# Altium schematic sheet FPGA.SchDoc: =ProjectName
size 420 x 297 mm; Author: T.P.; CompanyName: WUT; DrawnBy: T.P.; Organization: WUT ISE; Address1: Warsaw Univeristy of Technology; Address2: Nowowiejska 15/19; DocumentNumber: 3; Revision: 0.9; SheetNumber: 3; SheetTotal: 36; EDA_Number: ARTIQ; Projet: ARTIQ/SINARA; ModifiedBy: -; CreateDate: XX/XX/XXXX; CheckedDate: -; Title2: FPGA.SchDoc; DivGrp: ISE; Designer: G.K. and T.P.; ModifiedDate: -; ProjectName: ADC/DAC MEZZANINE
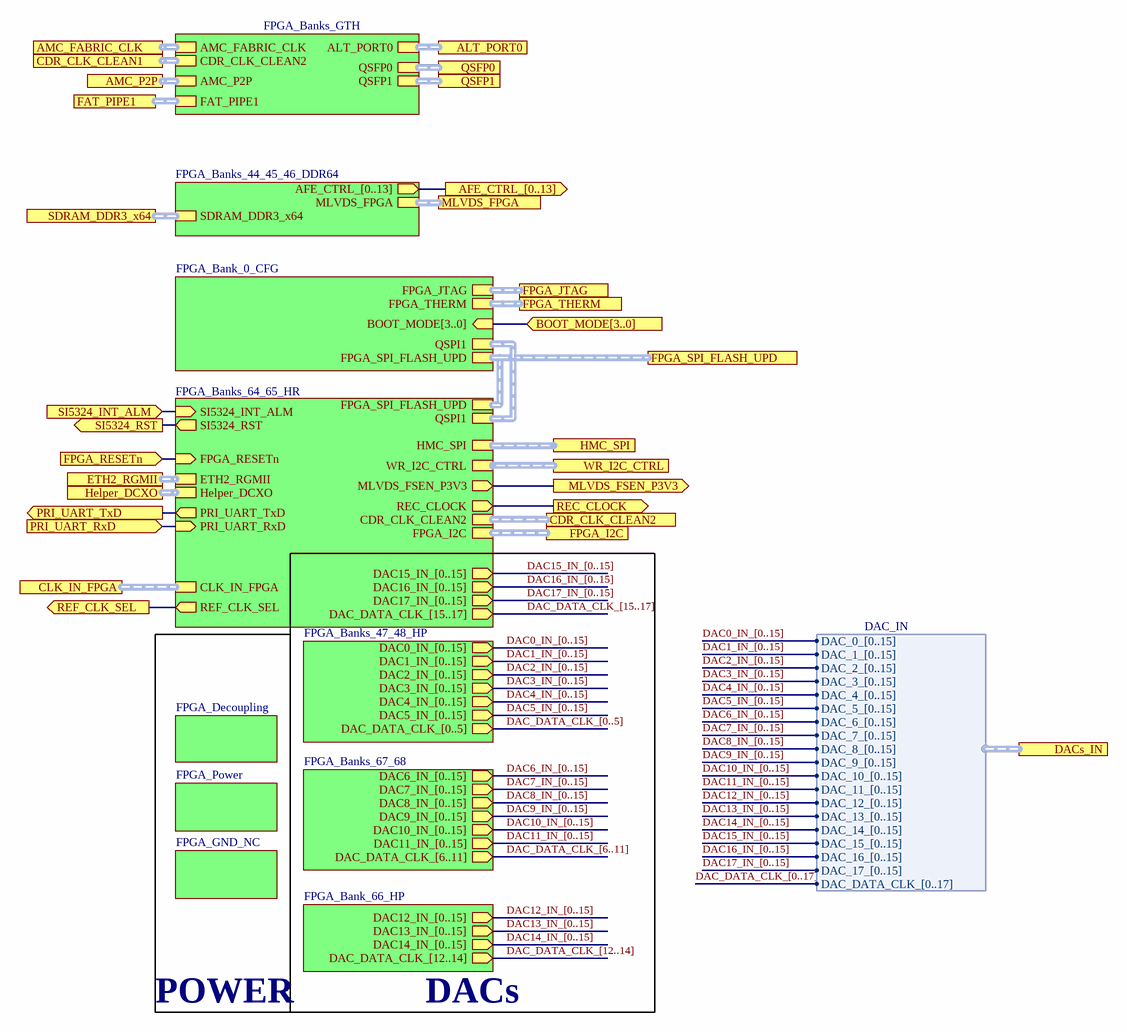
[diagram p0: FPGA.SchDoc]

## Sub-sheets
FPGA_Bank_0_CFG = FPGA_Bank_0_CFG.SchDoc: FPGA_SPI_FLASH_UPD (harness FLASH), FPGA_THERM (harness FPGA_THERM), BOOT_MODE[3..0] (in), FPGA_JTAG (harness JTAG), QSPI1
FPGA_Bank_66_HP = FPGA_Bank_66_HP.SchDoc: DAC12_IN_[0..15] (out), DAC14_IN_[0..15] (out), DAC13_IN_[0..15] (out), DAC_DATA_CLK_[12..14] (out)
FPGA_Banks_44_45_46_DDR64 = FPGA_Banks_44_45_46_DDR64.SchDoc: SDRAM_DDR3_x64 (harness SDRAM_64), MLVDS_FPGA (harness MLVDS_FPGA), AFE_CTRL_[0..13] (out)
FPGA_Banks_47_48_HP = FPGA_Banks_47_48_HP.SchDoc: DAC5_IN_[0..15] (out), DAC3_IN_[0..15] (out), DAC4_IN_[0..15] (out), DAC2_IN_[0..15] (out), DAC1_IN_[0..15] (out), DAC0_IN_[0..15] (out), DAC_DATA_CLK_[0..5] (out)
FPGA_Banks_64_65_HR = FPGA_Banks_64_65_HR.SchDoc: PRI_UART_TxD (out), SI5324_INT_ALM (in), FPGA_I2C (harness I2C), FPGA_RESETn (in), PRI_UART_RxD (in), SI5324_RST (out), FPGA_SPI_FLASH_UPD (harness FLASH), DAC17_IN_[0..15] (out), DAC15_IN_[0..15] (out), DAC16_IN_[0..15] (out), REF_CLK_SEL (out), DAC_DATA_CLK_[15..17] (out), CDR_CLK_CLEAN2 (harness CLK), REC_CLOCK (out), CLK_IN_FPGA (harness CLK), MLVDS_FSEN_P3V3 (out), QSPI1 (harness QSPI), WR_I2C_CTRL (harness WR_I2C_CTRL), HMC_SPI (harness SPI), Helper_DCXO (harness CLK), ETH2_RGMII (harness RGMII)
FPGA_Banks_67_68 = FPGA_Banks_67_68.SchDoc: DAC6_IN_[0..15] (out), DAC9_IN_[0..15] (out), DAC8_IN_[0..15] (out), DAC7_IN_[0..15] (out), DAC11_IN_[0..15] (out), DAC_DATA_CLK_[6..11] (out), DAC10_IN_[0..15] (out)
FPGA_Banks_GTH = FPGA_Banks_GTH.SchDoc: AMC_FABRIC_CLK (harness AMC_FABRIC_CLOCK), FAT_PIPE1 (harness FAT_PIPE1), CDR_CLK_CLEAN2 (harness CLK), AMC_P2P (harness P2P), QSFP0 (harness QSFP), ALT_PORT0 (harness PORT0), QSFP1 (harness QSFP)
FPGA_Decoupling = FPGA_Decoupling.SchDoc: no entries
FPGA_GND_NC = FPGA_GND_NC.SchDoc: no entries
FPGA_Power = FPGA_Power.SchDoc: no entries

## Ports
AFE_CTRL_[0..13] (out), ALT_PORT0 (harness PORT0), AMC_FABRIC_CLK (harness AMC_FABRIC_CLOCK), AMC_P2P (harness P2P), BOOT_MODE[3..0] (in), CDR_CLK_CLEAN1 (harness CLK), CDR_CLK_CLEAN2 (harness CLK), CLK_IN_FPGA (harness CLK), DACs_IN (harness DAC_IN), ETH2_RGMII (harness RGMII), FAT_PIPE1 (harness FAT_PIPE1), FPGA_I2C (harness I2C), FPGA_JTAG (harness JTAG), FPGA_RESETn (in), FPGA_SPI_FLASH_UPD (harness FLASH), FPGA_THERM (harness FPGA_THERM), Helper_DCXO (harness CLK), HMC_SPI (harness SPI), MLVDS_FPGA (harness MLVDS_FPGA), MLVDS_FSEN_P3V3 (out), PRI_UART_RxD (in), PRI_UART_TxD (out), QSFP0 (harness QSFP), QSFP1 (harness QSFP), REC_CLOCK (out), REF_CLK_SEL (out), SDRAM_DDR3_x64 (harness SDRAM_64), SI5324_INT_ALM (in), SI5324_RST (out), WR_I2C_CTRL (harness WR_I2C_CTRL)

## Harnesses
DAC_IN: DAC_0_[0..15], DAC_1_[0..15], DAC_2_[0..15], DAC_3_[0..15], DAC_4_[0..15], DAC_5_[0..15], DAC_6_[0..15], DAC_7_[0..15], DAC_8_[0..15], DAC_9_[0..15], DAC_10_[0..15], DAC_11_[0..15], DAC_12_[0..15], DAC_13_[0..15], DAC_14_[0..15], DAC_15_[0..15], DAC_16_[0..15], DAC_17_[0..15], DAC_DATA_CLK_[0..17]

## Nets
FPGA_RESETn: port FPGA_RESETn, sheet FPGA_Banks_64_65_HR/FPGA_RESETn
MLVDS_FSEN_P3V3: port MLVDS_FSEN_P3V3, sheet FPGA_Banks_64_65_HR/MLVDS_FSEN_P3V3
PRI_UART_RxD: port PRI_UART_RxD, sheet FPGA_Banks_64_65_HR/PRI_UART_RxD
PRI_UART_TxD: port PRI_UART_TxD, sheet FPGA_Banks_64_65_HR/PRI_UART_TxD
REC_CLOCK: port REC_CLOCK, sheet FPGA_Banks_64_65_HR/REC_CLOCK
REF_CLK_SEL: port REF_CLK_SEL, sheet FPGA_Banks_64_65_HR/REF_CLK_SEL
SI5324_INT_ALM: port SI5324_INT_ALM, sheet FPGA_Banks_64_65_HR/SI5324_INT_ALM
SI5324_RST: port SI5324_RST, sheet FPGA_Banks_64_65_HR/SI5324_RST

## Buses and harness runs
bus DAC0_IN_[0..15]
bus DAC0_IN_[0..15] = sheet FPGA_Banks_47_48_HP/DAC0_IN_[0..15]
bus DAC1_IN_[0..15]
bus DAC1_IN_[0..15] = sheet FPGA_Banks_47_48_HP/DAC1_IN_[0..15]
bus DAC2_IN_[0..15]
bus DAC2_IN_[0..15] = sheet FPGA_Banks_47_48_HP/DAC2_IN_[0..15]
bus DAC3_IN_[0..15]
bus DAC3_IN_[0..15] = sheet FPGA_Banks_47_48_HP/DAC3_IN_[0..15]
bus DAC4_IN_[0..15]
bus DAC4_IN_[0..15] = sheet FPGA_Banks_47_48_HP/DAC4_IN_[0..15]
bus DAC5_IN_[0..15]
bus DAC5_IN_[0..15] = sheet FPGA_Banks_47_48_HP/DAC5_IN_[0..15]
bus DAC6_IN_[0..15]
bus DAC6_IN_[0..15] = sheet FPGA_Banks_67_68/DAC6_IN_[0..15]
bus DAC7_IN_[0..15]
bus DAC7_IN_[0..15] = sheet FPGA_Banks_67_68/DAC7_IN_[0..15]
bus DAC8_IN_[0..15]
bus DAC8_IN_[0..15] = sheet FPGA_Banks_67_68/DAC8_IN_[0..15]
bus DAC9_IN_[0..15]
bus DAC9_IN_[0..15] = sheet FPGA_Banks_67_68/DAC9_IN_[0..15]
bus DAC10_IN_[0..15]
bus DAC10_IN_[0..15] = sheet FPGA_Banks_67_68/DAC10_IN_[0..15]
bus DAC11_IN_[0..15]
bus DAC11_IN_[0..15] = sheet FPGA_Banks_67_68/DAC11_IN_[0..15]
bus DAC12_IN_[0..15]
bus DAC12_IN_[0..15] = sheet FPGA_Bank_66_HP/DAC12_IN_[0..15]
bus DAC13_IN_[0..15]
bus DAC13_IN_[0..15] = sheet FPGA_Bank_66_HP/DAC13_IN_[0..15]
bus DAC14_IN_[0..15]
bus DAC14_IN_[0..15] = sheet FPGA_Bank_66_HP/DAC14_IN_[0..15]
bus DAC15_IN_[0..15]
bus DAC15_IN_[0..15] = sheet FPGA_Banks_64_65_HR/DAC15_IN_[0..15]
bus DAC16_IN_[0..15]
bus DAC16_IN_[0..15] = sheet FPGA_Banks_64_65_HR/DAC16_IN_[0..15]
bus DAC17_IN_[0..15]
bus DAC17_IN_[0..15] = sheet FPGA_Banks_64_65_HR/DAC17_IN_[0..15]
bus DAC_DATA_CLK_[0..5] = sheet FPGA_Banks_47_48_HP/DAC_DATA_CLK_[0..5]
bus DAC_DATA_CLK_[0..17]
bus DAC_DATA_CLK_[6..11] = sheet FPGA_Banks_67_68/DAC_DATA_CLK_[6..11]
bus DAC_DATA_CLK_[12..14] = sheet FPGA_Bank_66_HP/DAC_DATA_CLK_[12..14]
bus DAC_DATA_CLK_[15..17] = sheet FPGA_Banks_64_65_HR/DAC_DATA_CLK_[15..17]
bus port AFE_CTRL_[0..13] = sheet FPGA_Banks_44_45_46_DDR64/AFE_CTRL_[0..13]
bus port BOOT_MODE[3..0] = sheet FPGA_Bank_0_CFG/BOOT_MODE[3..0]
harness port ALT_PORT0 = sheet FPGA_Banks_GTH/ALT_PORT0
harness port AMC_FABRIC_CLK = sheet FPGA_Banks_GTH/AMC_FABRIC_CLK
harness port AMC_P2P = sheet FPGA_Banks_GTH/AMC_P2P
harness port CDR_CLK_CLEAN1 = sheet FPGA_Banks_GTH/CDR_CLK_CLEAN2
harness port CDR_CLK_CLEAN2 = sheet FPGA_Banks_64_65_HR/CDR_CLK_CLEAN2
harness port CLK_IN_FPGA = sheet FPGA_Banks_64_65_HR/CLK_IN_FPGA
harness port ETH2_RGMII = sheet FPGA_Banks_64_65_HR/ETH2_RGMII
harness port FAT_PIPE1 = sheet FPGA_Banks_GTH/FAT_PIPE1
harness port FPGA_I2C = sheet FPGA_Banks_64_65_HR/FPGA_I2C
harness port FPGA_JTAG = sheet FPGA_Bank_0_CFG/FPGA_JTAG
harness port FPGA_SPI_FLASH_UPD = sheet FPGA_Bank_0_CFG/FPGA_SPI_FLASH_UPD = sheet FPGA_Banks_64_65_HR/FPGA_SPI_FLASH_UPD
harness port FPGA_THERM = sheet FPGA_Bank_0_CFG/FPGA_THERM
harness port Helper_DCXO = sheet FPGA_Banks_64_65_HR/Helper_DCXO
harness port HMC_SPI = sheet FPGA_Banks_64_65_HR/HMC_SPI
harness port MLVDS_FPGA = sheet FPGA_Banks_44_45_46_DDR64/MLVDS_FPGA
harness port QSFP0 = sheet FPGA_Banks_GTH/QSFP0
harness port QSFP1 = sheet FPGA_Banks_GTH/QSFP1
harness port SDRAM_DDR3_x64 = sheet FPGA_Banks_44_45_46_DDR64/SDRAM_DDR3_x64
harness port WR_I2C_CTRL = sheet FPGA_Banks_64_65_HR/WR_I2C_CTRL
harness sheet FPGA_Bank_0_CFG/QSPI1 = sheet FPGA_Banks_64_65_HR/QSPI1

## Notes on the sheet
- POWER
- DACs
- Project/Equipment
- Document
- Designer
- Drawn by
- Check.by
- File
- Last Mod.
- Print Date
- Sheet
- Size
- A3
- of
- Rev